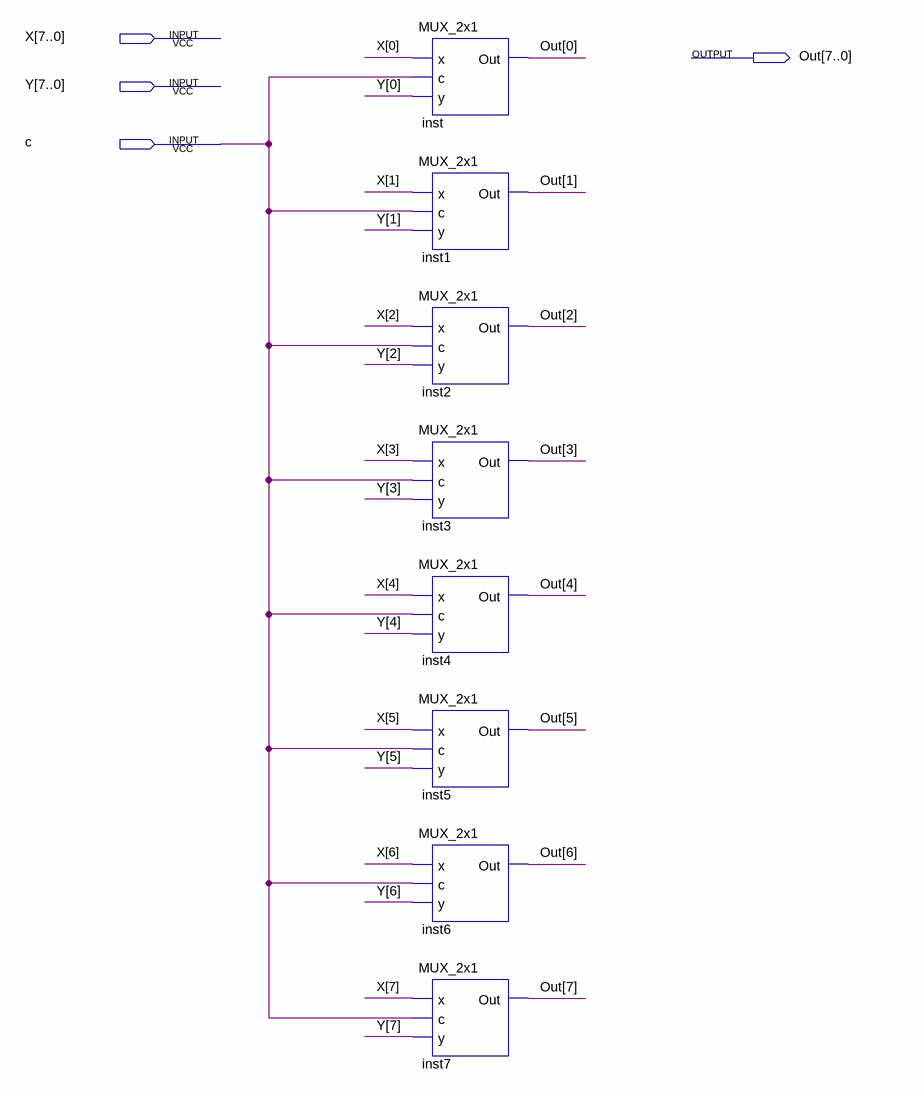
[diagram p0: schematic sheet]
// Quartus schematic MUX_2x1_8bits.bdf as structural Verilog: 8 symbols, 4 pins
module MUX_2x1_8bits (
  input  [7:0] X,
  input  [7:0] Y,
  input  c,
  output [7:0] Out
);

  MUX_2x1 inst (.x(X[0]), .c(c), .y(Y[0]), .Out(Out[0]));
  MUX_2x1 inst1 (.x(X[1]), .c(c), .y(Y[1]), .Out(Out[1]));
  MUX_2x1 inst2 (.x(X[2]), .c(c), .y(Y[2]), .Out(Out[2]));
  MUX_2x1 inst3 (.x(X[3]), .c(c), .y(Y[3]), .Out(Out[3]));
  MUX_2x1 inst4 (.x(X[4]), .c(c), .y(Y[4]), .Out(Out[4]));
  MUX_2x1 inst5 (.x(X[5]), .c(c), .y(Y[5]), .Out(Out[5]));
  MUX_2x1 inst6 (.x(X[6]), .c(c), .y(Y[6]), .Out(Out[6]));
  MUX_2x1 inst7 (.x(X[7]), .c(c), .y(Y[7]), .Out(Out[7]));
endmodule
